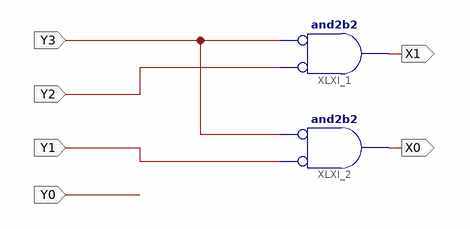
[diagram p0: schematic sheet 1]
// Xilinx ISE schematic encoder4to2.sch (spartan6) as structural Verilog: 2 symbols, 6 ports
module encoder4to2 (
  input  Y3,
  input  Y2,
  input  Y1,
  input  Y0,
  output X1,
  output X0
);

  and XLXI_1 (X1, ~Y2, ~Y3);  // and2b2
  and XLXI_2 (X0, ~Y1, ~Y3);  // and2b2
endmodule
